# Altium schematic sheet smart-watch.SchDoc
size A4; SheetNumber: 1; SheetTotal: 3
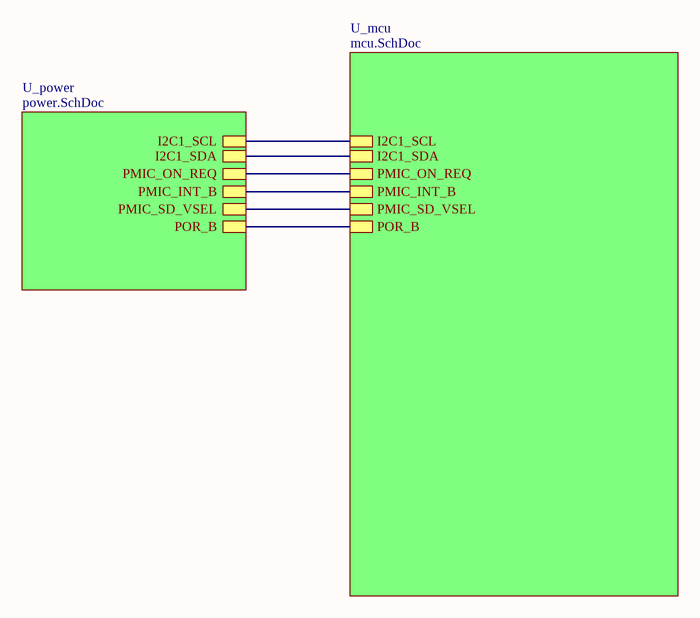
[diagram p0: smart-watch.SchDoc]

## Sub-sheets
U_mcu = mcu.SchDoc: I2C1_SCL, I2C1_SDA, PMIC_ON_REQ, PMIC_INT_B, PMIC_SD_VSEL, POR_B
U_power = power.SchDoc: I2C1_SCL, I2C1_SDA, PMIC_ON_REQ, PMIC_INT_B, PMIC_SD_VSEL, POR_B

## Nets
(unnamed): sheet U_mcu/I2C1_SCL, sheet U_power/I2C1_SCL
(unnamed): sheet U_mcu/I2C1_SDA, sheet U_power/I2C1_SDA
(unnamed): sheet U_mcu/PMIC_ON_REQ, sheet U_power/PMIC_ON_REQ
(unnamed): sheet U_mcu/PMIC_INT_B, sheet U_power/PMIC_INT_B
(unnamed): sheet U_mcu/PMIC_SD_VSEL, sheet U_power/PMIC_SD_VSEL
(unnamed): sheet U_mcu/POR_B, sheet U_power/POR_B

## Notes on the sheet
- THIS DOCUMENT AND THE DATA DISCLOSED HEREIN OR
- HEREWITH IS THE PROPERTY OF ALTIUM LIMITED AND MAY
- DWG NO:
- REVISION
- REV:
- DESCRIPTION
- DATE
- APPROVED
- BE FREELY DISTRIBUTED IN WHOLE. NO RIGHTS ARE
- RESERVED OR EXPRESS OR IMPLIED WARANTEE GIVEN.
- ENG:
- APPROVALS
- PROJECT
- DSN:
- CHK:
- REFERENCE DOCUMENTS
- PROJECT REVISION:
- TITLE
- DOCUMENT REVISION:
- DESIGN ITEM:
- BOM:
- FAB DWG:
- PCB DWG:
- ASSY DWG:
- SCALE:
- A3
- SIZE
- CAGE CODE
- FILE NAME
- DWG NO.
- SHEET
- OF
- REV